# EAGLE design PRZYSTAWKA 230 - ILUMINOFONIA (EAGLE 8.7.0)
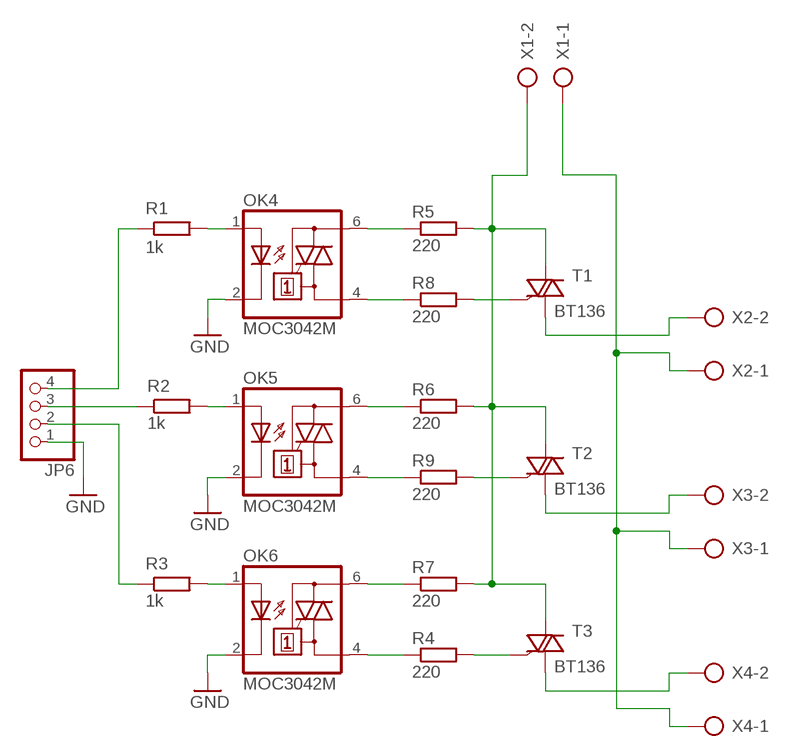
[diagram p0: schematic, sheet 1]

## Parts
JP6  PINHD-1X4  [1X04]
OK4  MOC3042M  [DIL06]
OK5  MOC3042M  [DIL06]
OK6  MOC3042M  [DIL06]
R1  1k  R_EU  [204/5]
R2  1k  R_EU  [204/5]
R3  1k  R_EU  [204/5]
R4  220  R_EU  [204/5]
R5  220  R_EU  [204/5]
R6  220  R_EU  [204/5]
R7  220  R_EU  [204/5]
R8  220  R_EU  [204/5]
R9  220  R_EU  [204/5]
T1  BT136  [TO220AB]
T2  BT136  [TO220AB]
T3  BT136  [TO220AB]
X1  AK300/2  [AK300/2]
X2  AK300/2  [AK300/2]
X3  AK300/2  [AK300/2]
X4  AK300/2  [AK300/2]

## Nets
GND: JP6.1 OK4.2(C) OK5.2(C) OK6.2(C)
N$1: OK5.1(A) R2.P$2
N$2: OK4.1(A) R1.P$2
N$3: OK6.1(A) R3.P$2
N$4: OK4.6(A2) R5.P$1
N$5: OK4.4(A1) R8.P$1
N$6: JP6.4 R1.P$1
N$7: JP6.3 R2.P$1
N$8: JP6.2 R3.P$1
N$9: OK5.6(A2) R6.P$1
N$10: OK5.4(A1) R9.P$1
N$11: OK6.6(A2) R7.P$1
N$12: OK6.4(A1) R4.P$1
N$13: R4.P$2 T3.3(G)
N$14: R9.P$2 T2.3(G)
N$15: R8.P$2 T1.3(G)
N$16: R5.P$2 R6.P$2 R7.P$2 T1.2(A2) T2.2(A2) T3.2(A2) X1.2
N$19: T3.1(A1) X4.2
N$20: T2.1(A1) X3.2
N$21: T1.1(A1) X2.2
N$22: X1.1 X2.1 X3.1 X4.1

## Library data of the parts
JP6 = pinhead:PINHD-1X4: PIN HEADER
OK4-OK6 = optocoupler:MOC30*: 6-Pin DIP Zero-Cross Optoisolators Triac Driver Output (250/400 Volt Peak) Source: Data sheet <http://www.fairchildsemi.com/ds/MO/MOC3031M.pdf> The old path of data sheet not more available 2013-05-06.; MF: FAIRCHILD SEMICONDUCTOR; MPN: MOC3042-M; OC_FARNELL: 1021368; OC_NEWARK: 72K8899
R1-R9 = Rezystory:R_EU
T1-T3 = triac:BT136: Triac BT136 series E sensitive gate Source: http://www.nxp.com/acrobat_download/datasheets/BT136_SERIES_E_2.pdf
X1-X4 = con-ptr500:AK300/2: CONNECTOR; OC_FARNELL: unknown; OC_NEWARK: unknown

## Board
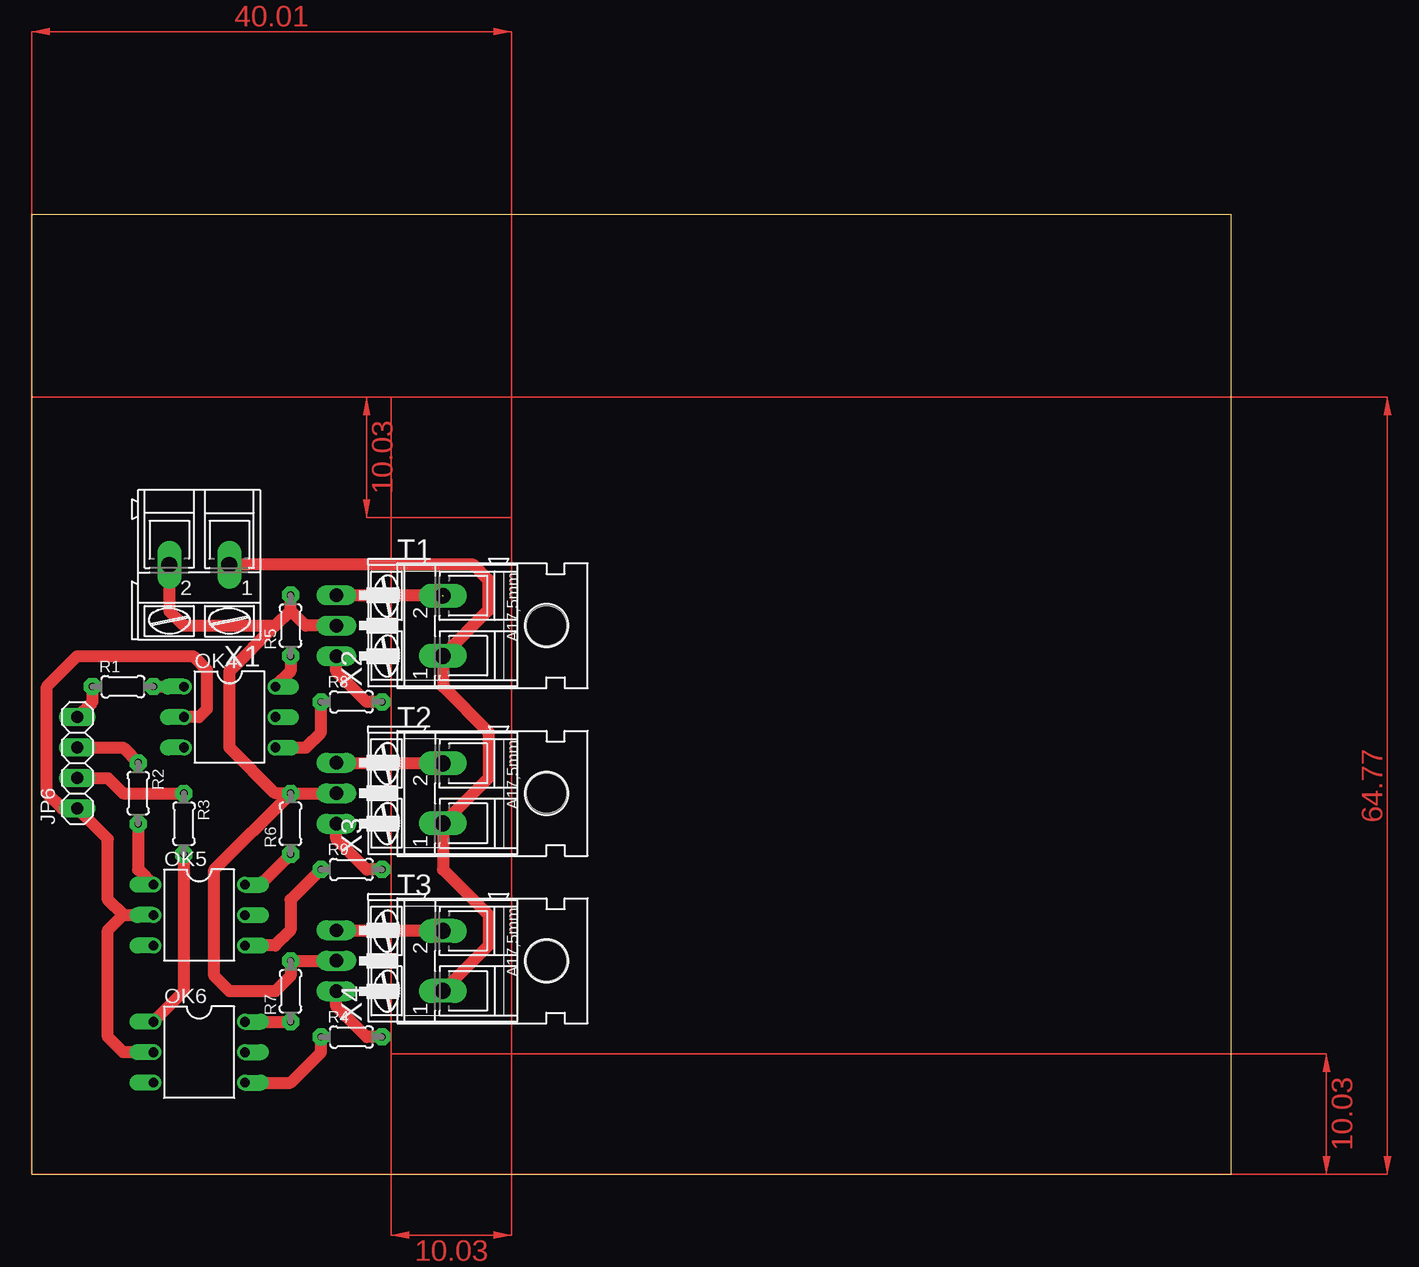
[diagram p1: board, top side]

Size 100 x 80 mm. Coordinates in mm from the lower left corner, seen from the top.
Outline: 0,0 100,0 100,80 0,80 0,0
Copper layers (1*16): Top 0.035mm / dielectric 1.5mm / Bottom 0.035mm
Design rules "default": minimum track width 6mil, minimum drill 0.35mm, track to track 6mil, track to pad 6mil, pad to pad 6mil, via to via 6mil, smd to smd 6mil, copper to edge 40mil, drill to drill 6mil, minimum pad ring 10mil, minimum via ring 8mil, stop-mask expansion 4mil, vias tented up to drill 0mil, thermal gap 10mil

### Footprints (pad centres in the part's own frame; a part is rotated, then mirrored left to right if it is on the bottom)
1X04 = drill 1.016 long: 1 -3.81,0; 2 -1.27,0; 3 1.27,0; 4 3.81,0
DIL06 = drill 0.813 offset: 1 -2.54,-3.81; 2 0,-3.81; 3 2.54,-3.81; 4 2.54,3.81; 5 0,3.81; 6 -2.54,3.81
204/5 = drill 0.6 pad 1.422 octagon: P$1 -2.54,0; P$2 2.54,0
TO220AB = drill 1.118 long: 1 -2.54,-6.35; 2 0,-6.35; 3 2.54,-6.35 | hole 3.302: 0,11.176
AK300/2 = drill 1.321 long: 1 -2.515,0; 2 2.489,0

### Placement (x,y rotation side)
JP6  3.81,34.29 90 top
OK4  16.51,38.1 270 top
OK5  13.97,21.59 270 top
OK6  13.97,10.16 270 top
R1  7.62,40.64 0 top
R2  8.89,31.75 270 top
R3  12.7,29.21 270 top
R4  26.67,11.43 0 top
R5  21.59,45.72 90 top
R6  21.59,29.21 90 top
R7  21.59,15.24 90 top
R8  26.67,39.37 0 top
R9  26.67,25.4 0 top
T1  31.75,45.72 270 top
T2  31.75,31.75 270 top
T3  31.75,17.78 270 top
X1  13.97,50.8 180 top
X2  34.29,45.72 90 top
X3  34.29,31.75 90 top
X4  34.29,17.78 90 top

### Tracks (layer width: path | path; a pad name or v marks a point on that pad's centre or on a via)
GND
  Top 1.016: 7.62,21.59 6.35,20.32 6.35,11.43 7.62,10.16 OK6.2 | 7.62,21.59 OK5.2 | 7.62,21.59 6.35,22.86 6.35,27.94 JP6.1 2.54,30.48 1.27,31.75 1.27,40.64 3.81,43.18 13.46,43.18 14.61,42.04 14.61,38.73 13.97,38.1 OK4.2
N$1
  Top 1.016: R2.P$2 8.89,25.4 OK5.1
N$2
  Top 1.016: R1.P$2 OK4.1
N$3
  Top 1.016: R3.P$2 12.7,15.24 OK6.1
N$4
  Top 1.016: R5.P$1 21.59,41.91 OK4.6
N$5
  Top 1.016: OK4.4 22.86,35.56 24.13,36.83 R8.P$1
N$6
  Top 1.016: JP6.4 5.08,39.37 R1.P$1
N$7
  Top 1.016: JP6.3 7.62,35.56 R2.P$1
N$8
  Top 1.016: JP6.2 6.35,33.02 7.62,31.75 R3.P$1
N$9
  Top 1.016: R6.P$1 19.05,24.13 OK5.6
N$10
  Top 1.016: R9.P$1 21.59,22.86 21.59,20.32 20.32,19.05 OK5.4
N$11
  Top 1.016: OK6.6 R7.P$1
N$12
  Top 1.016: OK6.4 21.59,7.62 24.13,10.16 R4.P$1
N$13
  Top 1.016: R4.P$2 27.94,11.43 25.4,13.97 T3.3
N$14
  Top 1.016: R9.P$2 27.94,25.4 25.4,27.94 T2.3
N$15
  Top 1.016: R8.P$2 27.94,39.37 25.4,41.91 T1.3
N$16
  Top 1.016: T3.2 R7.P$2 21.59,16.51 20.32,15.24 16.51,15.24 15.24,16.51 15.24,25.4 R6.P$2 | R6.P$2 T2.2 | X1.2 11.48,46.94 12.7,45.72 20.32,45.72 | 20.32,45.72 21.59,46.99 | 21.59,46.99 R5.P$2 | T1.2 22.86,45.72 21.59,46.99 | R6.P$2 20.32,31.75 16.51,35.56 16.51,41.91 20.32,45.72
N$19
  Top 1.016: X4.2 25.45,20.27 T3.1
N$20
  Top 1.016: X3.2 25.45,34.24 T2.1
N$21  (1 unrouted)
  Top 1.016: T1.1 34.24,48.26
N$22
  Top 1.016: X1.1 36.83,50.8 38.1,49.53 38.1,47.02 X2.1 34.29,40.64 38.1,36.83 38.1,33.05 X3.1 34.29,25.4 38.1,21.59 38.1,19.07 X4.1
(copper drawn outside any net)
  shapes: Top area x5